# EAGLE design lumVoiture (EAGLE 8.7.0)
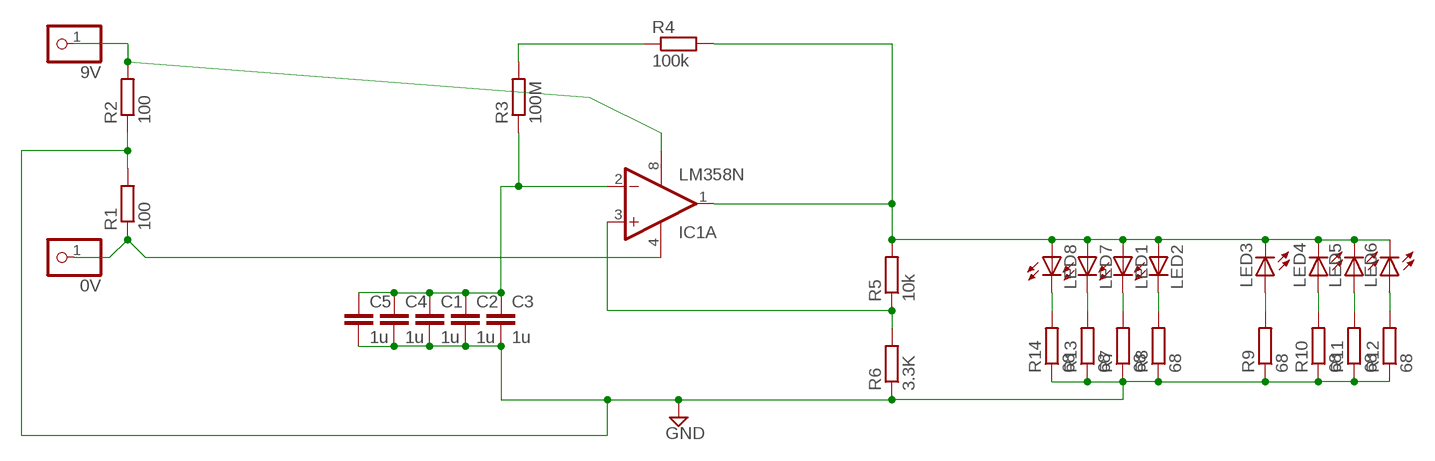
[diagram p0: schematic, sheet 1]

## Parts
0V  PINHD-1X1  [1X01]
9V  PINHD-1X1  [1X01]
C1  1u  C-EU025-025X050  [C025-025X050]
C2  1u  C-EU025-025X050  [C025-025X050]
C3  1u  C-EU025-025X050  [C025-025X050]
C4  1u  C-EU025-025X050  [C025-025X050]
C5  1u  C-EU025-025X050  [C025-025X050]
IC1  LM358N  [DIL08]
LED1  LED5MM  [LED5MM]
LED2  LED5MM  [LED5MM]
LED3  LED5MM  [LED5MM]
LED4  LED5MM  [LED5MM]
LED5  LED5MM  [LED5MM]
LED6  LED5MM  [LED5MM]
LED7  LED5MM  [LED5MM]
LED8  LED5MM  [LED5MM]
R1  100  R-EU_0207/10  [0207/10]
R2  100  R-EU_0207/10  [0207/10]
R3  100M  R-EU_0207/10  [0207/10]
R4  100k  R-EU_0207/10  [0207/10]
R5  10k  R-EU_0207/10  [0207/10]
R6  3.3K  R-EU_0207/10  [0207/10]
R7  68  R-EU_0207/10  [0207/10]
R8  68  R-EU_0207/10  [0207/10]
R9  68  R-EU_0207/10  [0207/10]
R10  68  R-EU_0207/10  [0207/10]
R11  68  R-EU_0207/10  [0207/10]
R12  68  R-EU_0207/10  [0207/10]
R13  68  R-EU_0207/10  [0207/10]
R14  68  R-EU_0207/10  [0207/10]

## Nets
GND: C1.2 C2.2 C3.2 C4.2 C5.2 R1.2 R2.1 R6.1 R7.1 R8.1 R9.1 R10.1 R11.1 R12.1 R13.1 R14.1
N$1: LED1.K(C) R7.2
N$2: R3.2 R4.1
N$3: 0V.1 IC1.4(P:V-) R1.1
N$4: IC1.3(A:+IN) R5.1 R6.2
N$5: LED2.K(C) R8.2
N$6: C1.1 C2.1 C3.1 C4.1 C5.1 IC1.2(A:-IN) R3.1
N$7: LED3.A R9.2
N$8: LED4.A R10.2
N$9: LED8.K(C) R14.2
N$10: IC1.1(A:OUT) LED1.A LED2.A LED3.K(C) LED4.K(C) LED5.K(C) LED6.K(C) LED7.A LED8.A R4.2 R5.2
N$11: LED7.K(C) R13.2
N$12: 9V.1 IC1.8(P:V+) R2.2
N$13: LED5.A R11.2
N$14: LED6.A R12.2
Unconnected: IC1.5(B:+IN) IC1.6(B:-IN) IC1.7(B:OUT)

## Library data of the parts
0V 9V = pinhead:PINHD-1X1: PIN HEADER
C1-C5 = rcl:C-EU: CAPACITOR, European symbol; SPICEPREFIX: C
IC1 = linear:LM358: OP AMP also LM158; LM258; LM2904 Source: http://cache.national.com/ds/LM/LM158.pdf
LED1-LED8 = led:LED: LED OSRAM: - CHIPLED LG R971, LG N971, LY N971, LG Q971, LY Q971, LO R971, LY R971 LH N974, LH R974 LS Q976, LO Q976, LY Q976 LO Q996 - Hyper CHIPLED LW Q18S LB Q993, LB Q99A, LB R99A - SideLED LS A670, LO A670, LY A670, LG A670, LP A670 LB A673, LV A673, LT A673, LW A673 LH A674 LY A675 LS A676, LA A676, LO A676, LY A676, LW A676 LS A679, LY A679, LG A679 - Hyper Micro SIDELED® LS Y876, LA Y876, LO Y876, LY Y876 LT Y87S - SmartLED LW L88C, LW L88S LB L89C, LB L89S, LG L890 LS L89K, LO L89K, LY L89K LS L896, LA L896, LO L896, LY L896 - TOPLED LS T670, LO T670, LY T670, LG T670, LP T670 LSG T670, LSP T670, LSY T670, LOP T670, LYG T670 LG T671, LOG T671, LSG T671 LB T673, LV T673, LT T673, LW T673 LH T674 LS T676, LA T676, LO T676, LY T676, LB T676, LH T676, LSB T676, LW T676 LB T67C, LV T67C, LT T67C, LS T67K, LO T67K, LY T67K, LW E67C LS E67B, LA E67B, LO E67B, LY E67B, LB E67C, LV E67C, LT E67C LW T67C LS T679, LY T679, LG T679 LS T770, LO T770, LY T770, LG T770, LP T770 LB T773, LV T773, LT T773, LW T773 LH T774 LS E675, LA E675, LY E675, LS T675 LS T776, LA T776, LO T776, LY T776, LB T776 LHGB T686 LT T68C, LB T68C - Hyper Mini TOPLED® LB M676 - Mini TOPLED Santana® LG M470 LS M47K, LO M47K, LY M47K Source: http://www.osram.convergy.de LUXEON: - LUMILED® LXK2-PW12-R00, LXK2-PW12-S00, LXK2-PW14-U00, LXK2-PW14-V00 LXK2-PM12-R00, LXK2-PM12-S00, LXK2-PM14-U00 LXK2-PE12-Q00, LXK2-PE12-R00, LXK2-PE12-S00, LXK2-PE14-T00, LXK2-PE14-U00 LXK2-PB12-K00, LXK2-PB12-L00, LXK2-PB12-M00, LXK2-PB14-N00, LXK2-PB14-P00, LXK2-PB14-Q00 LXK2-PR12-L00, LXK2-PR12-M00, LXK2-PR14-Q00, LXK2-PR14-R00 LXK2-PD12-Q00, LXK2-PD12-R00, LXK2-PD12-S00 LXK2-PH12-R00, LXK2-PH12-S00 LXK2-PL12-P00, LXK2-PL12-Q00, LXK2-PL12-R00 Source: www.luxeon.com KINGBRIGHT: KA-3528ASYC Source: www.kingbright.com
R1-R14 = rcl:R-EU_: RESISTOR, European symbol; SPICEPREFIX: R

## Board
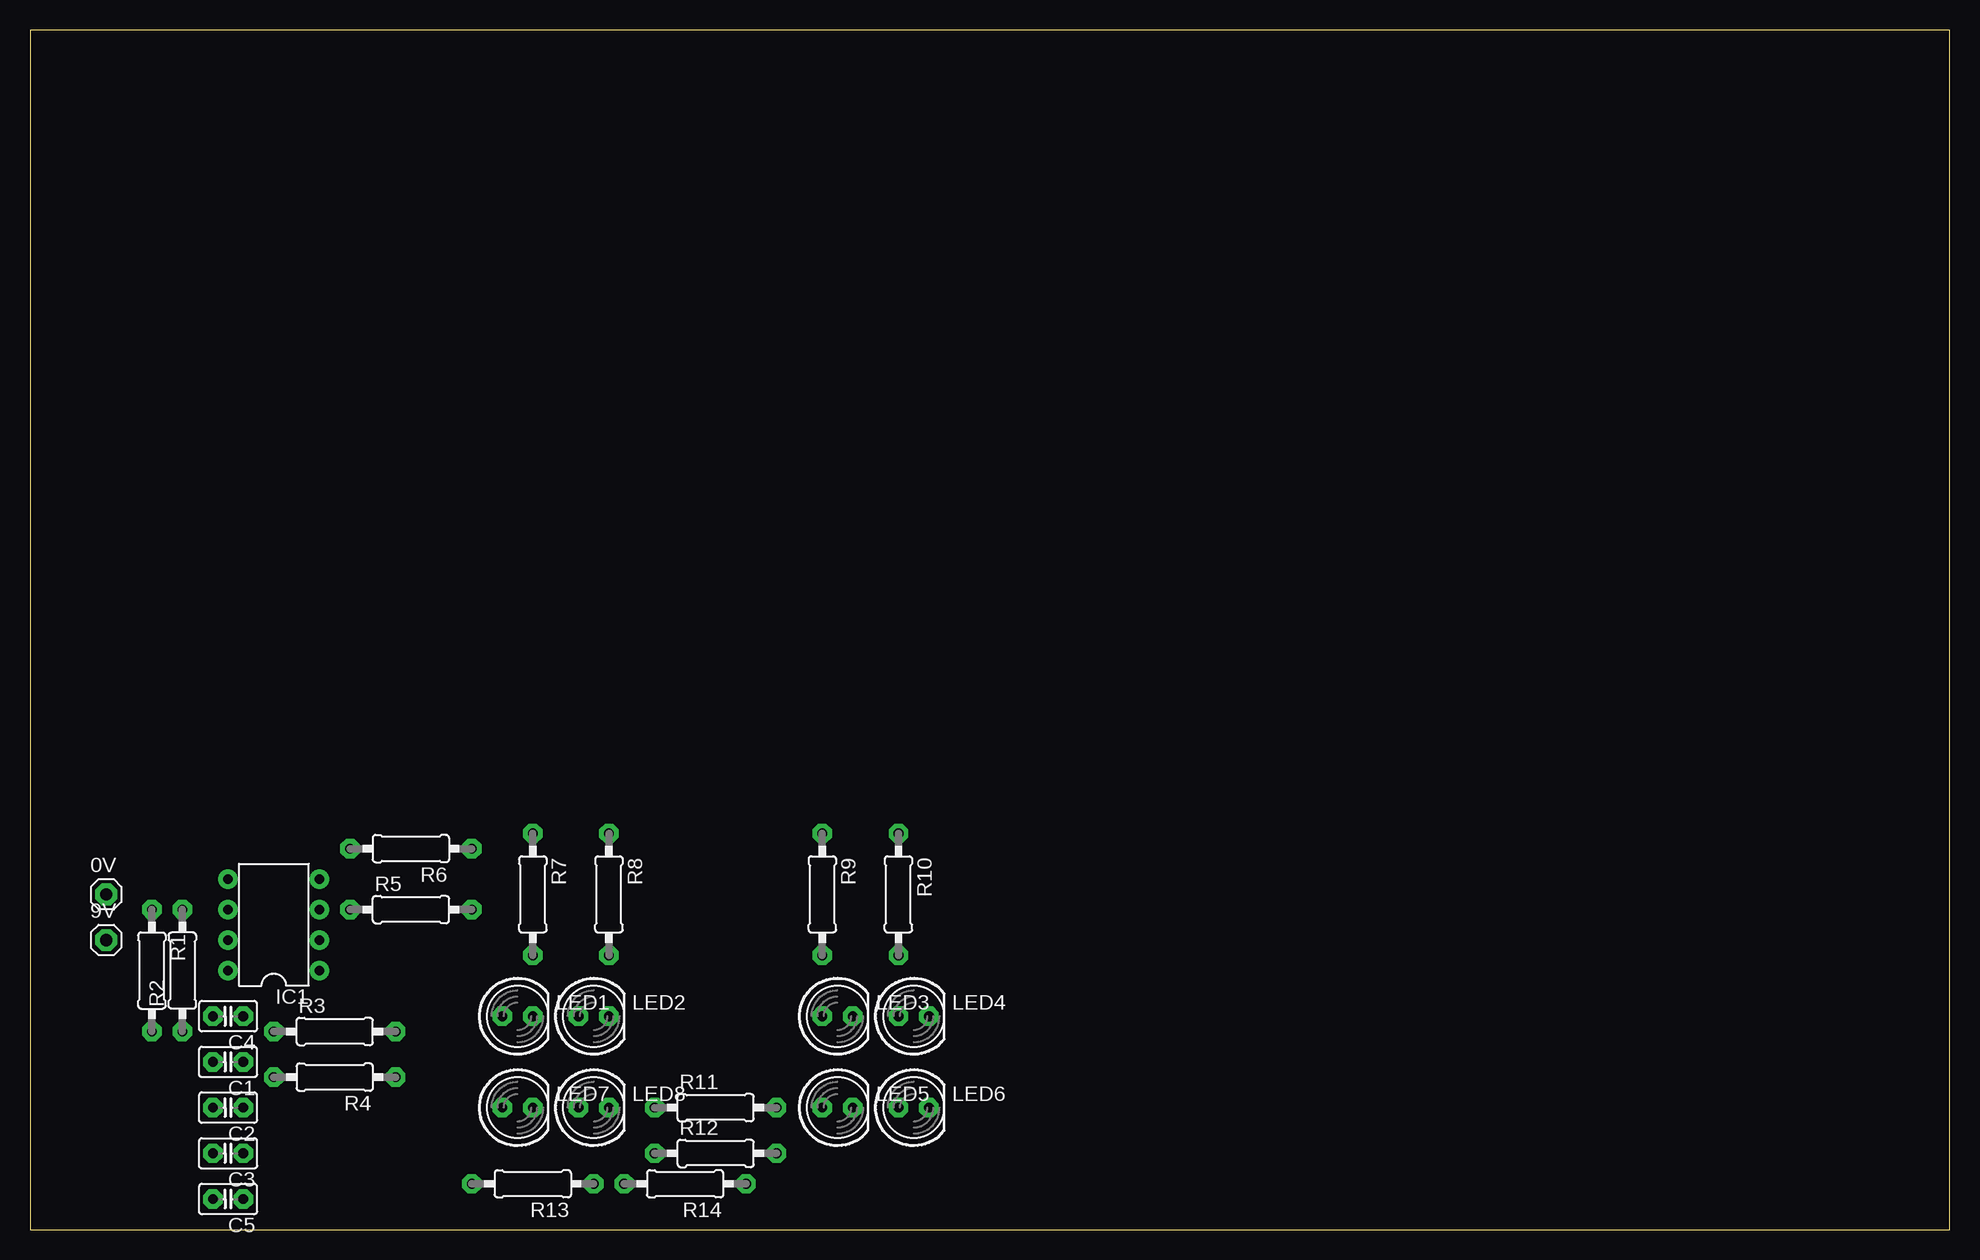
[diagram p1: board, top side]
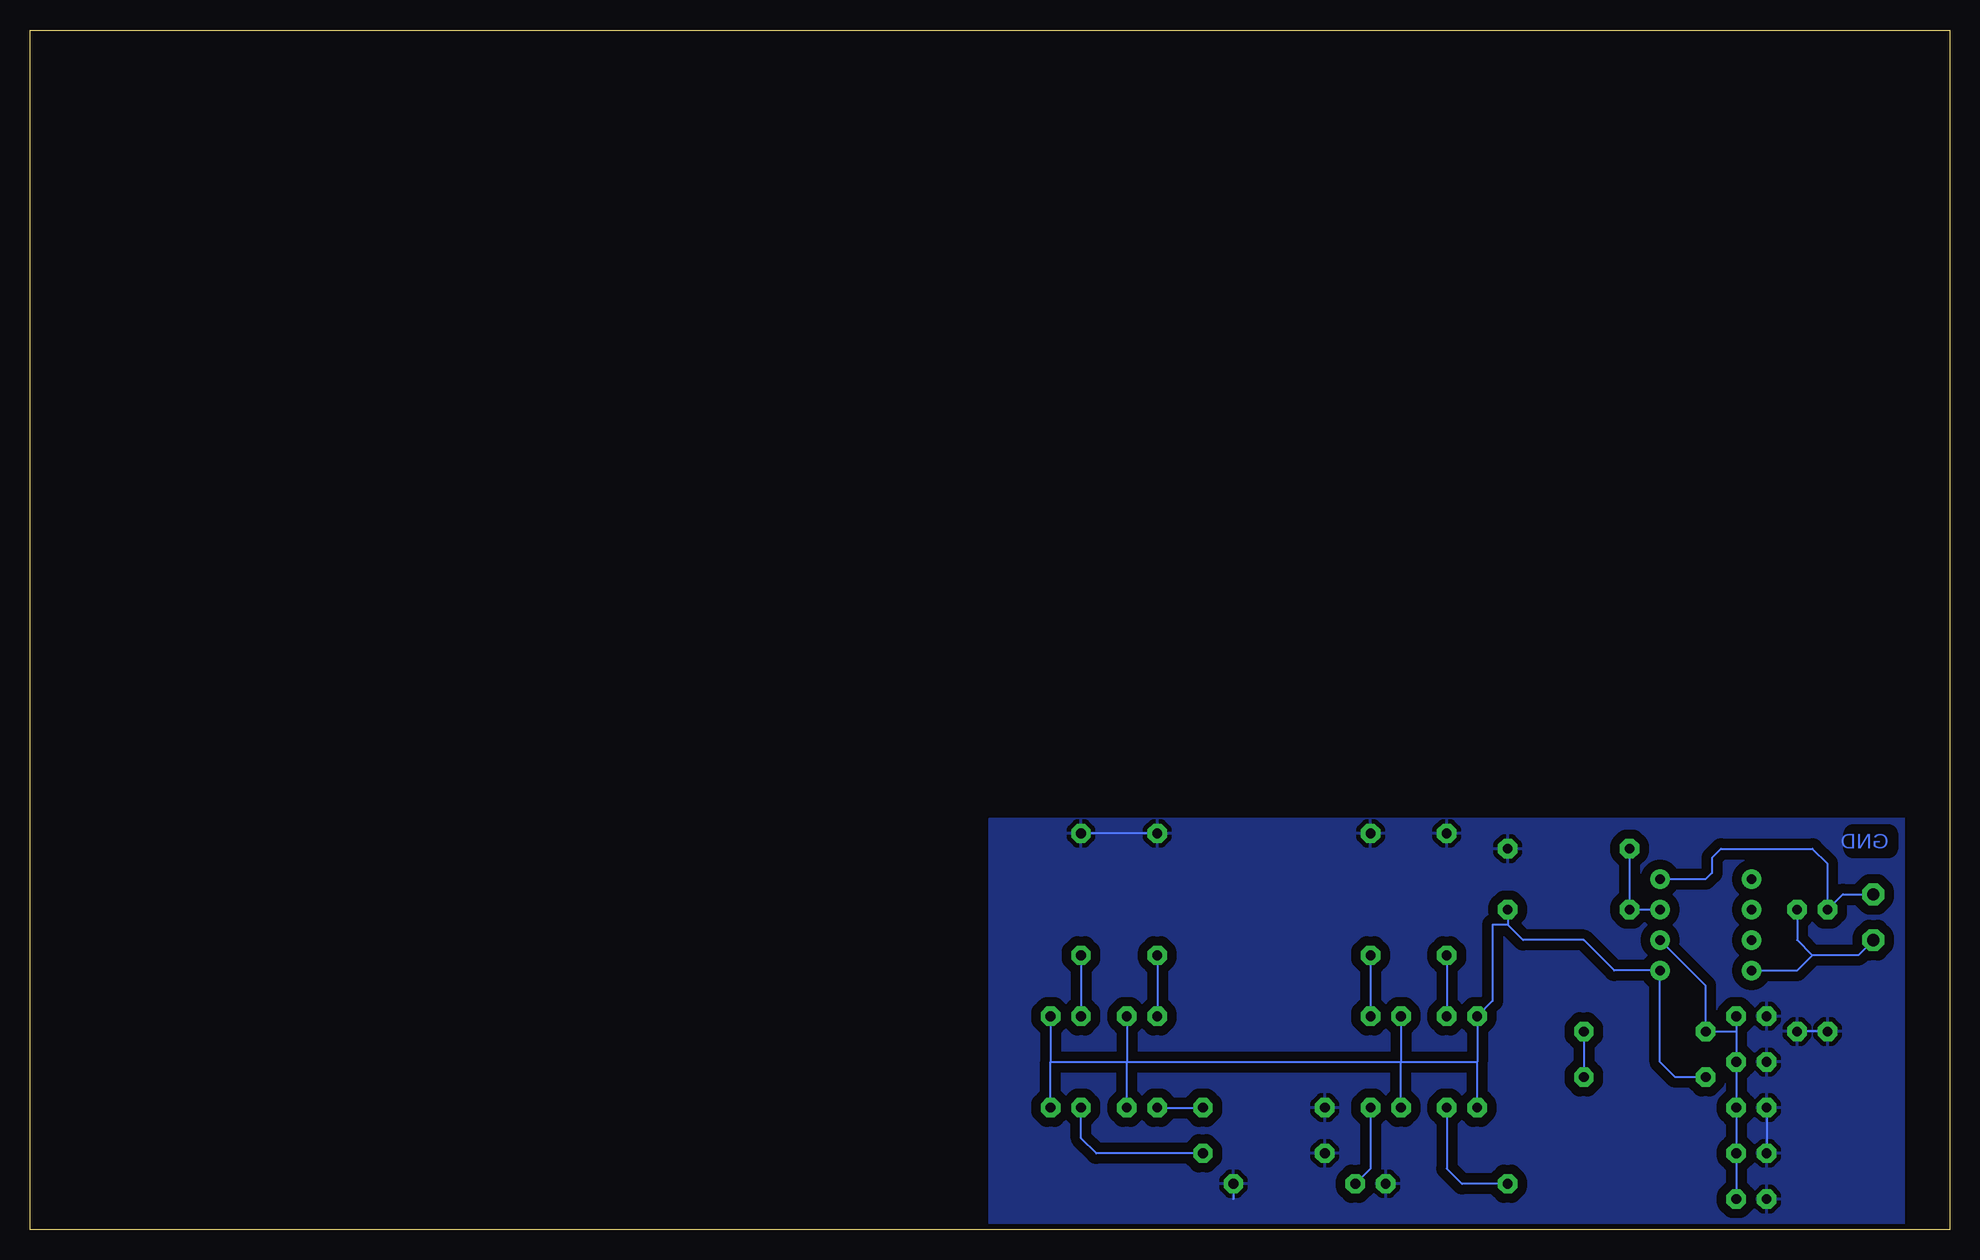
[diagram p2: board, bottom side, seen from below]

Size 160 x 100 mm. Coordinates in mm from the lower left corner, seen from the top.
Outline: 0,0 160,0 160,100 0,100 0,0
Copper layers (1*16): Top 0.035mm / dielectric 1.55mm / Bottom 0.035mm
Design rules "default": minimum track width 0.8mm, minimum drill 0.6mm, track to track 0.8mm, track to pad 0.7mm, pad to pad 0.7mm, via to via 0.7mm, smd to smd 0.1mm, copper to edge 0.45mm, drill to drill 0.3mm, minimum pad ring 0.4mm, minimum via ring 0.4mm, stop-mask expansion 0.1mm, vias tented up to drill 0mil, thermal gap 0.4mm

### Footprints (pad centres in the part's own frame; a part is rotated, then mirrored left to right if it is on the bottom)
1X01 = drill 1.016 octagon: 1 0,0
C025-025X050 = drill 0.813 octagon: 1 -1.27,0; 2 1.27,0
DIL08 = drill 0.813 pad 1.27: 1 -3.81,-3.81; 2 -1.27,-3.81; 3 1.27,-3.81; 4 3.81,-3.81; 5 3.81,3.81; 6 1.27,3.81; 7 -1.27,3.81; 8 -3.81,3.81
LED5MM = drill 0.813 octagon: A -1.27,0; K 1.27,0
0207/10 = drill 0.813 octagon: 1 -5.08,0; 2 5.08,0

### Placement (x,y rotation side)
0V  6.35,27.94 0 top
9V  6.35,24.13 0 top
C1  16.51,13.97 180 top
C2  16.51,10.16 180 top
C3  16.51,6.35 180 top
C4  16.51,17.78 180 top
C5  16.51,2.54 180 top
IC1  20.32,25.4 90 top
LED1  40.64,17.78 0 top
LED2  46.99,17.78 0 top
LED3  67.31,17.78 0 top
LED4  73.66,17.78 0 top
LED5  67.31,10.16 0 top
LED6  73.66,10.16 0 top
LED7  40.64,10.16 0 top
LED8  46.99,10.16 0 top
R1  10.16,21.59 270 top
R2  12.7,21.59 90 top
R3  25.4,16.51 0 top
R4  25.4,12.7 180 top
R5  31.75,26.67 0 top
R6  31.75,31.75 180 top
R7  41.91,27.94 270 top
R8  48.26,27.94 270 top
R9  66.04,27.94 270 top
R10  72.39,27.94 270 top
R11  57.15,10.16 0 top
R12  57.15,6.35 0 top
R13  41.91,3.81 180 top
R14  54.61,3.81 180 top

### Tracks (layer width: path | path; a pad name or v marks a point on that pad's centre or on a via)
GND
  Bottom 0.152: R14.1 59.69,2.54 | C2.2 C3.2 | R1.2 R2.1 | R9.1 R10.1
  pour Bottom: 3.81,34.29 3.81,0 80.01,0 80.01,34.29
N$1
  Bottom 0.152: R7.2 LED1.K
N$2
  Bottom 0.152: R3.2 R4.1
N$3
  Bottom 0.152: IC1.4 20.32,29.21 19.81,29.72 19.81,30.99 19.05,31.75 11.43,31.75 10.16,30.48 R1.1 8.89,27.94 0V.1
N$4
  Bottom 0.152: R6.2 R5.1 IC1.3
N$5
  Bottom 0.152: R8.2 LED2.K
N$6
  Bottom 0.152: IC1.2 20.32,20.32 R3.1 17.78,16.51 | C4.1 17.78,16.51 | 17.78,16.51 C1.1 C2.1 C3.1 C5.1
N$7
  Bottom 0.152: R9.2 LED3.A
N$8
  Bottom 0.152: R10.2 LED4.A
N$9
  Bottom 0.152: LED8.K 48.26,5.08 R14.2
N$10
  Bottom 0.152: LED3.K 68.58,13.97 | LED4.K 74.93,13.97 | 74.93,13.97 68.58,13.97 | LED6.K 74.93,13.97 | LED5.K 68.58,13.97 | 68.58,13.97 45.72,13.97 | LED2.A 45.72,13.97 | LED8.A 45.72,13.97 | LED7.A 39.37,13.97 | 45.72,13.97 39.37,13.97 | 39.37,13.97 LED1.A 38.1,19.05 38.1,25.4 36.83,25.4 | R4.2 22.86,12.7 24.13,13.97 IC1.1 27.94,21.59 30.48,24.13 35.56,24.13 36.83,25.4 | R5.2 36.83,25.4
N$11
  Bottom 0.152: R13.2 40.64,3.81 41.91,5.08 LED7.K
N$12
  Bottom 0.152: IC1.8 12.7,21.59 11.43,22.86 | 11.43,22.86 12.7,24.13 R2.2 | 9V.1 7.62,22.86 11.43,22.86
N$13
  Bottom 0.152: LED5.A R11.2
N$14
  Bottom 0.152: LED6.A 72.39,7.62 71.12,6.35 R12.2

### Text on the board
Bottom: GND